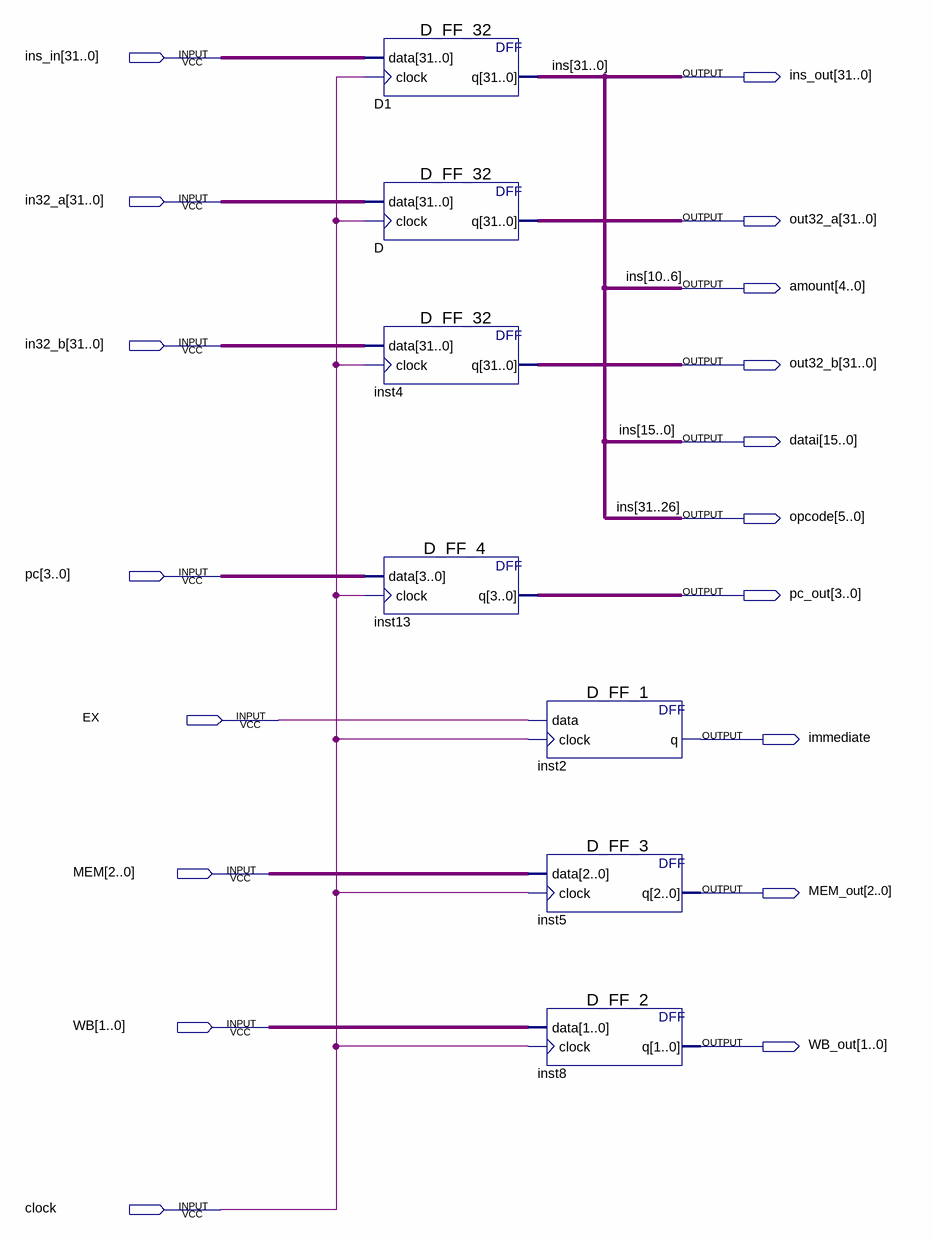
[diagram p0: schematic sheet]
// Quartus schematic ID_EX.bdf as structural Verilog: 7 symbols, 18 pins
module ID_EX (
  input  [31:0] ins_in,
  input  [31:0] in32_a,
  input  [31:0] in32_b,
  input  [3:0] pc,
  input  EX,
  input  [2:0] MEM,
  input  [1:0] WB,
  input  clock,
  output [31:0] ins_out,
  output [31:0] out32_a,
  output [4:0] amount,
  output [31:0] out32_b,
  output [15:0] datai,
  output [5:0] opcode,
  output [3:0] pc_out,
  output immediate,
  output [2:0] MEM_out,
  output [1:0] WB_out
);

  D_FF_32 D1 (.data(ins_in), .clock(clock), .q({ins_out[31:16], datai[15:11], amount, datai[5:0]}));
  D_FF_32 D (.data(in32_a), .clock(clock), .q(out32_a));
  D_FF_32 inst4 (.data(in32_b), .clock(clock), .q(out32_b));
  D_FF_4 inst13 (.data(pc), .clock(clock), .q(pc_out));
  D_FF_1 inst2 (.data(EX), .clock(clock), .q(immediate));
  D_FF_3 inst5 (.data(MEM), .clock(clock), .q(MEM_out));
  D_FF_2 inst8 (.data(WB), .clock(clock), .q(WB_out));

  assign datai[10:6] = amount;
  assign ins_out[15:0] = {datai[15:11], amount, datai[5:0]};
  assign opcode = ins_out[31:26];

  // Other names for the same wires on the sheet: ins[31:0] = {ins_out[31:16], datai[15:11], amount, datai[5:0]}
endmodule
